# Altium project Li-Ion_Battery_Charger.PrjPcb
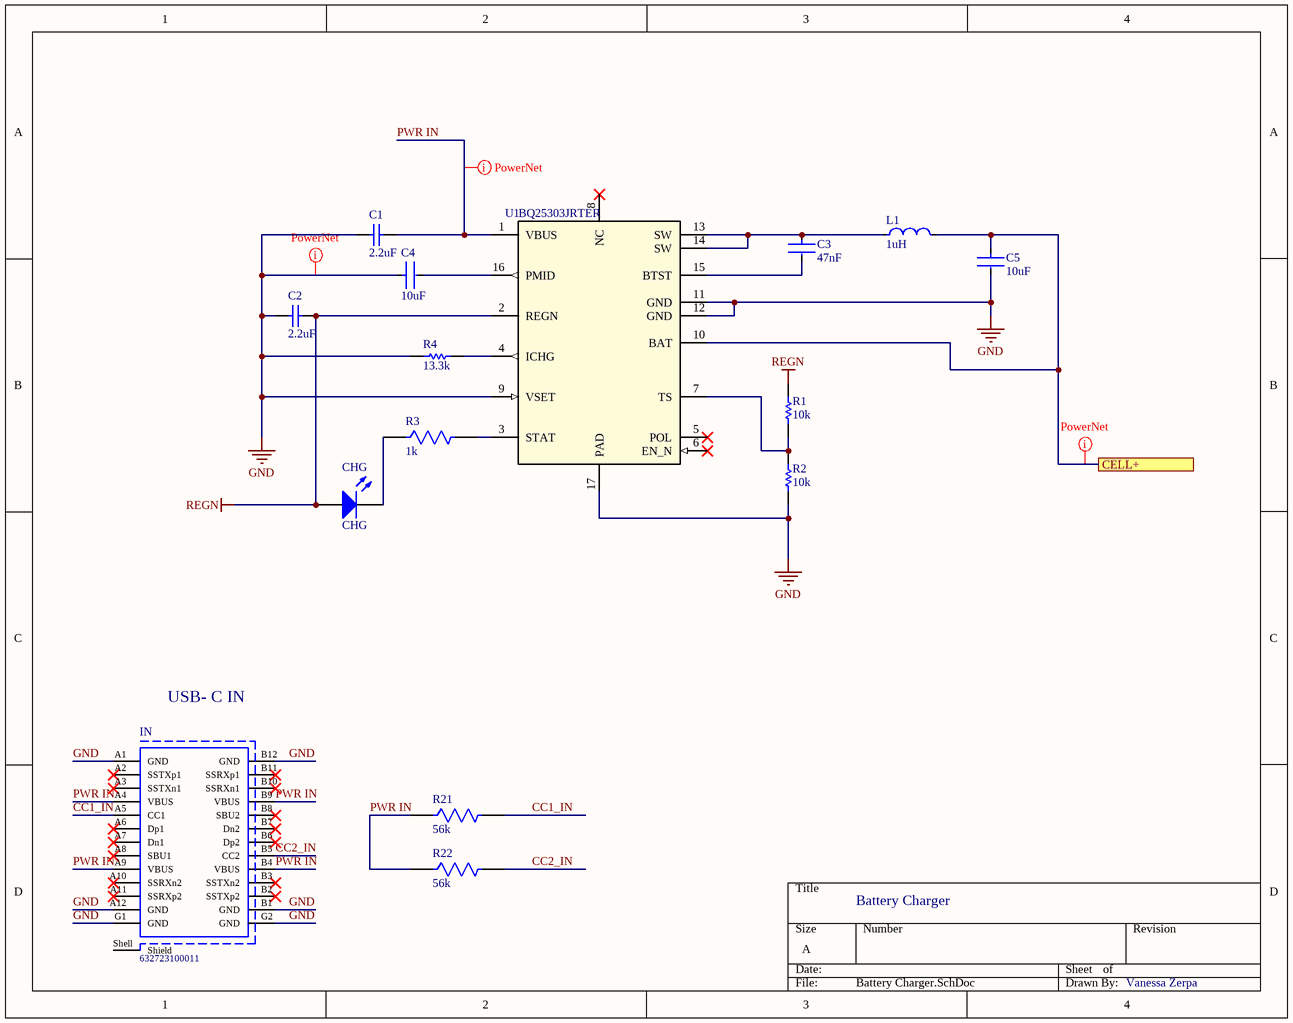
[diagram p0: Battery Charger.SchDoc]
4 sheets, 53 parts. Net scope: flat (ports and power ports of the same name join across sheets).
Board file: Li-IonBatteryCharger.PcbDoc
Sheets:
  Battery Charger.SchDoc
  Boost Converter.SchDoc
  Battery Protection.SchDoc
  Battery Fuel Gauge.SchDoc

## Sheet Battery Charger.SchDoc
size A; SheetNumber: 1; SheetTotal: 4

### Parts
C1  2.2uF  [CAPC2013X152X50ML20T25]
C2  2.2uF  [CAPC2013X152X50ML20T25]
C3  47nF  [FP-C0805C-DN-MFG]
C4  10uF  [FP-C0805C-DG-MFG]
C5  10uF  [FP-C0805C-DG-MFG]
CHG  CHG  [0805_A]
IN  632723100011  [632723100011]
L1  1uH  [FP-LQM21DN_00-MFG]
R1  10k  [RESC2013X60X35NL10T20]
R2  10k  [RESC2013X60X35NL10T20]
R3  1k  [FP-CRCW0805-HPe3-IPC_A]
R4  13.3k  [RESC2013X70X40LL20T20]
R21  56k  [FP-CRCW0805-e3-IPC_B]
R22  56k  [FP-CRCW0805-e3-IPC_B]
U1  BQ25303JRTER  [RTE0016C]

### Ports
CELL+

### Nets
GND: C1.1 C2.1 C4.1 C5.2 IN.A1(GND) IN.A12(GND) IN.B1(GND) IN.B12(GND) IN.G1(GND) IN.G2(GND) R2.1 R4.1 U1.9(VSET) U1.11(GND) U1.12(GND) U1.17(PAD)
REGN: C2.2 CHG.2(A) R1.2 U1.2(REGN)
CC1_IN: IN.A5(CC1) R21.2
CC2_IN: IN.B5(CC2) R22.2
PWR IN: C1.2 IN.A4(VBUS) IN.A9(VBUS) IN.B4(VBUS) IN.B9(VBUS) R21.1 R22.1 U1.1(VBUS)
NetBATT_1: C5.1 L1.2 U1.10(BAT) ; port CELL+
NetC3_1: C3.1 L1.1 U1.13(SW) U1.14(SW)
NetC3_2: C3.2 U1.15(BTST)
NetC4_2: C4.2 U1.16(PMID)
NetCHG_1: CHG.1(K) R3.1
NetR1_1: R1.1 R2.2 U1.7(TS)
NetR3_2: R3.2 U1.3(STAT)
NetR4_2: R4.2 U1.4(ICHG)

Not connected (* = marked no-connect by the designer): IN A2(SSTXp1)* A3(SSTXn1)* A6(Dp1)* A7(Dn1)* A8(SBU1)* A10(SSRXn2)* A11(SSRXp2)* B2(SSTXp2)* B3(SSTXn2)* B6(Dp2)* B7(Dn2)* B8(SBU2)* B10(SSRXn1)* B11(SSRXp1)* Shell(Shield); U1 5(POL)* 6(EN_N)* 8(NC)*

### Layout directives
net class PowerNets: GND, NetBATT_1, PWR IN

### Notes on the sheet
- USB- C IN
- Battery Charger
- Vanessa Zerpa

### Library data of the parts
C1 C2 = CMP-2007-04514-1: Part Number: 08053C225KAT2A; Manufacturer: AVX Interconnect / Elco
C3 = CMP-2007-03315-2: CAP CER 0.047UF 25V 5% NP0 0805; Manufacturer Part Number: C0805C473J3GACTU; Manufacturer: KEMET; Tolerance: 0.05; Temperature Coefficient: 30ppm/°C; Material: Ceramic; Capacitance: 47,000 pF; Value: 47,000 pF; Temperature Characteristic: C0G; Device Class L3: Ceramic Capacitors; Temperature Range Low: -55°C; Category: Cap; Lead Free: Yes; Digikey Description: CAP CER 0.047UF 25V 5% NP0 0805; Ipc Land Pattern Name: CAPC200125X78; Device Class L1: Passive Components; Device Class L2: Capacitors; Temperature: -55°C to +125°C; Voltage Rating: 25 V; Height: 0.88mm; Package: C0805C-DN; Automotive: No; Octopart: https://octopart.com/c0805c473j3gactu-kemet-9563153; ComponentLink2Description: Datasheet; Mouser Description: Multilayer Ceramic Capacitors MLCC - SMD/SMT 25volts 0.047uF 5% C0G; ComponentLink2URL: https://content.kemet.com/datasheets/KEM_C1003_C0G_SMD.pdf; RoHS: TRUE; Temperature Range High: +125°C
C4 C5 = CMP-2007-03243-2: CAP CER 10UF 10V X5R 0805; Manufacturer Part Number: C0805C106K8PACTU; Manufacturer: Kemet; 3DS Part Number: 220-00001; Tolerance: 10%; Temperature Coefficient: 15%; Material: Ceramic; Device Class L2: Capacitors; Device Class L1: Passive Components; ComponentLink2URL: https://content.kemet.com/datasheets/KEM_C1006_X5R_SMD.pdf; Height: 1.4mm; Lead Free: Yes; Digikey Description: CAP CER 10UF 10V X5R 0805; Octopart: https://octopart.com/c0805c106k8pactu-kemet-98697; Capacitance: 10uF; Value: 10uF; Temperature Range Low: -55°C; Temperature: -55°C to +85°C; Automotive: No; Mouser Description: CAP CER 10UF 10V X5R 0805; Ipc Land Pattern Name: CAPC200125X125; Temperature Range High: +85°C; Voltage: 10V; RoHS: TRUE; Device Class L3: Ceramic Capacitors; ComponentLink2Description: Datasheet; Voltage Rating: 10V; Package: C0805C-DG; Temperature Characteristic: X5R; Category: Cap
CHG = CMP-1426-00011-1: SMD mono-color Chip LED, WL-SMCW, Red; PartNumber: 150080RS75000; Manufacturer: Wuerth Elektronik; Color: Red; PackageReference: 0805_A; ComponentLink2Description: Datasheet; ComponentLink1URL: http://www.we-online.com; ComponentLink1Description: Manufacturer URL; ComponentLink2URL: http://katalog.we-online.com/led/datasheet/150080RS75000.pdf
IN = CMP-1502-03213-1: USB 3.1 Type C Receptacle WR-COM, Horizontal, SMT / THT; Manufacturer: Wurth Elektronik; Working Voltage: 20VDC; Rated Current: 5A; Contact Resistance: 30mOhm; Operating Temperature: -40to105degC; Publisher: WurthElektronik; Gender: Receptacle; Part Number: 632723100011; Mounting Technology: SMT/THT; Datasheet URL: https://katalog.we-online.de/em/datasheet/632723x00011%282%29.pdf; Connector Type: USB3.1TypeC; Manufacturer URL: http://www.we-online.de; Orientation: Horizontal; Package Reference: 632723100011; Packaging: TapeandReel
L1 = CMP-06042-012978-1: Multilayer Type Inductor for General Circuits, 0805 (2012), 1μH, 10%, 0.4Ω, 50mA; Q Factor: 45; Test Frequency: 10MHz; DC Resistance (DCR): 400mR; Core Material: Ferrite; Shielding: Shielded; Self Resonant Frequency: 107MHz; Mount: Surface Mount; Depth: 1.45mm; Current Rating: 50mA; Lead Free: Lead Free; Height - Seated (Max): 0.041inch; Inductance Tolerance: 10%; Min Operating Temperature: -40°C; Height: 0.85mm; Radiation Hardening: No; Width: 1.25mm; Length: 2mm; Case Code (Imperial): 0805; Termination: SMD/SMT; Package Quantity: 1; Max Operating Temperature: 85°C; Case Code (Metric): 2012; Case/Package: 0805; Max DC Current: 50mA; DC Current: 50mA; Inductance: 1uH; Military Standard: Not; REACH SVHC: No SVHC; Packaging: Tape and Reel; Tolerance: 10%
R1 R2 = CMP-1659-00013-4: Chip Resistor, 10 KOhm, +/- 1%, 0.125 W, -55 to 155 degC, 0805 (2012 Metric), RoHS, Tape and Reel; Manufacturer: Yageo; Voltage Rating: 150 V; Mount: Surface Mount; ComponentLink1Description: Manufacturer URL; ComponentLink2URL: http://www.yageo.com/documents/recent/PYu-RC_Group_51_RoHS_L_04.pdf; Pins: 2; Length: 2 mm; Min Operating Temperature: -55 degC; Height: 0.5 mm; Mounting Technology: Surface Mount; RoHSCompliant: true; REACH SVHC: No SVHC; ComponentLink1URL: http://www.yageo.com/; Max Operating Temperature: 155 degC; PackageReference: 0805; DatasheetVersion: Rev. 4, 02/2016; Package Quantity: 5000; Packaging: Tape and Reel; ComponentLink2Description: Datasheet; PackageDescription: 2-Pin Surface Mounted Device, Body 2 x 1.25 mm
R3 = CMP-02407-004529-1: RES Thick Film, 1kΩ, 1%, 0.5W, 100ppm/°C, 0805; Resistance: 1kR; Voltage Rating (DC): 150V; Power Rating: 330mW; Contact Plating: Tin; Composition: Thick Film; Packaging: Tape and Reel; Min Operating Temperature: -55°C; Weight: 0.000194oz; Case/Package: 0805; Case Code (Imperial): 0805; Case Code (Metric): 2012; Height: 0.5mm; Military Standard: Not; Lead Free: Lead Free; Voltage Rating: 150V; Number of Pins: 2; Max Operating Temperature: 155°C; Package Quantity: 5000; Mount: Surface Mount; Temperature Coefficient: 100ppm/°C; Tolerance: 1%; Radiation Hardening: No; Depth: 1.25mm; Length: 2mm; Termination: Solder; Width: 1.2mm
R4 = CMP-2001-04421-1: Manufacturer: Panasonic; Part Number: ERJ-6ENF1332V
R21 R22 = CMP-2001-04015-2: RES Thick Film, 56kΩ, 1%, 0.125W, 100ppm/°C, 0805; Resistance: 56kR; Power Rating: 125mW; Voltage Rating: 150V; Depth: 1.25mm; Contact Plating: Tin; Package Quantity: 10; Min Operating Temperature: -55°C; Case/Package: 0805; Packaging: Tape and Reel; Lead Free: Lead Free; Case Code (Imperial): 0805; Tolerance: 1%; Height: 0.45mm; Max Operating Temperature: 155°C; Case Code (Metric): 2012; Number of Pins: 2; Width: 1.25mm; Mount: Surface Mount; Voltage Rating (DC): 150V; Max Power Dissipation: 125mW; Weight: 0.000194oz; Termination: SMD/SMT; Length: 2mm; Radiation Hardening: No; Composition: Thick Film; Features: Automotive AEC-Q200; Number of Terminations: 2; Temperature Coefficient: 100ppm/°C; Military Standard: Not
U1 = BQ25303JRTER: Standalone 1-cell 17-V, 3.0-A battery charger with JEITA battery temperature monitoring 16-WQFN -40 to 85; Mfr_Name: Texas Instruments; Type: DEV; RefDes: RefDes; Copyright: Copyright (C) 2021 Ultra Librarian. All rights reserved.; Manufacturer_Part_Number: BQ25303JRTER; Supplier 1: Mouser; Manufacturer: Texas Instruments; Manufacturer Part Number: BQ25303JRTER; RoHS: Yes; Category: Integrated Circuits (ICs); Stock 1: 48; Pricing 1: 1=2.18000, 10=1.97000, 25=1.86000, 50=1.86000, 100=1.59000, 250=1.49000, 500=1.30000, 1000=1.08000, 3000=1.07000, 10000=1.07000 (USD); Supplier Part Number 1: 595-BQ25303JRTER

## Sheet Boost Converter.SchDoc
size A; SheetNumber: 2; SheetTotal: 4
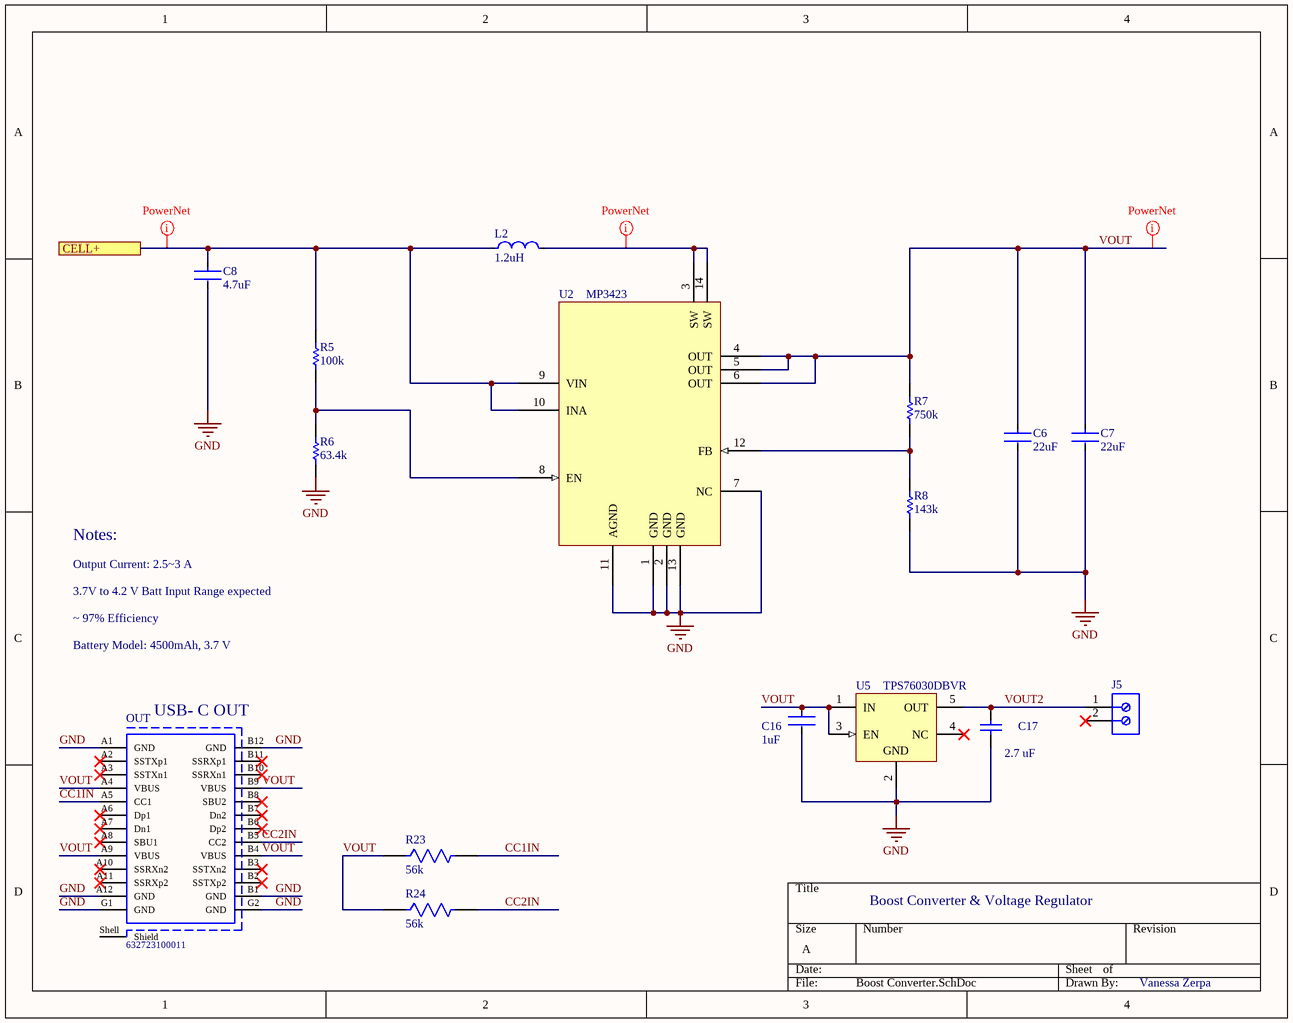
[diagram p1: Boost Converter.SchDoc]

### Parts
C6  22uF  [FP-GRM21B-0_15-MFG]
C7  22uF  [FP-GRM21B-0_15-MFG]
C8  4.7uF  [FP-0805-L_2_01_0_2-W_1_25-MFG]
C16  1uF  [FP-CC0805-0_85-MFG]
C17  2.7 uF  [CAPC2013X145X50LL20T25]
J5  691101710002  [691101710002]  (value not drawn)
L2  1.2uH  [FP-LQW21HN_00-MFG]
OUT  632723100011  [632723100011]
R5  100k  [RESC2013X60X35ML10T20]
R6  63.4k  [RESC2013X50X30LL20T20]
R7  750k  [RESC2013X50X30LL20T20]
R8  143k  [RESC2013X70X40LL20T20]
R23  56k  [FP-CRCW0805-e3-IPC_B]
R24  56k  [FP-CRCW0805-e3-IPC_B]
U2  MP3423  [MP3422GGZ]
U5  TPS76030DBVR  [DBV0005A_L]

### Ports
CELL+

### Nets
GND: C6.2 C7.2 C8.2 C16.2 C17.2 OUT.A1(GND) OUT.A12(GND) OUT.B1(GND) OUT.B12(GND) OUT.G1(GND) OUT.G2(GND) R6.1 R8.1 U2.1(GND) U2.2(GND) U2.7(NC) U2.11(AGND) U2.13(GND) U5.2(GND)
CC1IN: OUT.A5(CC1) R23.2
CC2IN: OUT.B5(CC2) R24.2
VOUT: C6.1 C7.1 C16.1 OUT.A4(VBUS) OUT.A9(VBUS) OUT.B4(VBUS) OUT.B9(VBUS) R7.2 R23.1 R24.1 U2.4(OUT) U2.5(OUT) U2.6(OUT) U5.1(IN) U5.3(EN)
VOUT2: C17.1 J5.1 U5.5(OUT)
NetBATT_1: C8.1 L2.1 R5.2 U2.9(VIN) U2.10(INA) ; port CELL+
NetL2_2: L2.2 U2.3(SW) U2.14(SW)
NetR5_1: R5.1 R6.2 U2.8(EN)
NetR7_1: R7.1 R8.2 U2.12(FB)

Not connected (* = marked no-connect by the designer): J5 2*; OUT A2(SSTXp1)* A3(SSTXn1)* A6(Dp1)* A7(Dn1)* A8(SBU1)* A10(SSRXn2)* A11(SSRXp2)* B2(SSTXp2)* B3(SSTXn2)* B6(Dp2)* B7(Dn2)* B8(SBU2)* B10(SSRXn1)* B11(SSRXp1)* Shell(Shield); U5 4(NC)*

### Layout directives
net class PowerNets: NetBATT_1, NetL2_2, VOUT

### Notes on the sheet
- Notes:
- Output Current: 2.5~3 A
- 3.7V to 4.2 V Batt Input Range expected
- ~ 97% Efficiency
- Battery Model: 4500mAh, 3.7 V
- (near OUT) USB- C OUT
- Boost Converter & Voltage Regulator
- Vanessa Zerpa

### Library data of the parts
C6 C7 = CMP-2007-03385-2: Chip Multilayer Ceramic Capacitors for General Purpose, 0805, 22uF, X5R, 15%, 20%, 6.3V; Material: Ceramic; Max Operating Temperature: 85°C; Voltage: 6.3V; Min Operating Temperature: -55°C; Case/Package: 0805; Thickness: 0.053inch; Dielectric: X5R; Packaging: Tape and Reel; Depth: 1.25mm; Termination: SMD/SMT; Voltage Rating (DC): 6.3V; Radiation Hardening: No; Tolerance: 20%; Mount: Surface Mount; Lead Free: Lead Free; Package Quantity: 1; REACH SVHC: No SVHC; Voltage Rating: 6.3V; Capacitance: 22uF; Length: 2mm; Case Code (Imperial): 0805; Case Code (Metric): 2012; Width: 0.049inch; Height: 1.25mm
C8 = CMP-2007-04518-2: General Purpose Ceramic Capacitor, 0805, 4.7uF, 10%, X7R, 15%, 16V; Dissipation Factor: 3.5%; Voltage: 10V; Height: 1.52mm; Package Quantity: 1; Voltage Rating: 16V; RoHS Compliant: Yes; Mount: Surface Mount; REACH SVHC: No SVHC; Number of Pins: 2; Packaging: Tape and Reel; Radiation Hardening: No; Thickness: 0.06inch; Width: 0.049inch; Length: 2.01mm; Termination: SMD/SMT; Case Code (Metric): 2012; Max Operating Temperature: 125°C; Construction: Flat; Series: -; Depth: 1.25mm; Voltage Rating (DC): 16V; Dielectric: X7R; Contact Plating: Tin; Tolerance: 10%; Capacitance: 4.7uF; Lead Free: Lead Free; Min Operating Temperature: -55°C; Case Code (Imperial): 0805; Case/Package: 0805
C16 = CMP-03422-000182-1: CAP CER 1UF 10V X7R 0805; Manufacturer: Yageo; Manufacturer Part Number: CC0805KKX7R6BB105; Material: Ceramic; Tolerance: 0.1; Value: 1 uF; ComponentLink2URL: http://www.yageo.com/documents/recent/UPY-GPHC_Y5V_6.3V-to-50V_8.pdf; Automotive: No; Temperature Range Low: -30°C; Octopart: https://octopart.com/cc0805kkx7r6bb105-yageo-42522859; Temperature Characteristic: X7R; RoHS: TRUE; Voltage Rating: 10 V; Capacitance: 1 uF; Package: CC0805-0.85; Device Class L3: Ceramic Capacitors; Category: Cap; Mouser Description: Multilayer Ceramic Capacitors MLCC - SMD/SMT 1.0uF 10V X7R 10%; Temperature Range High: +85°C; Ipc Land Pattern Name: CAPC200125X85; ComponentLink2Description: Datasheet; Temperature: -30°C to +85°C; Height: 0.95mm; Lead Free: Yes; Device Class L1: Passive Components; Device Class L2: Capacitors; Footprint Url: http://www.yageo.com/exep/pages/download/literatures/UPY-C_GEN_24.pdf; Digikey Description: CAP CER 1UF 10V X7R 0805
C17 = CMP-1036-04849-2: Part Number: C0805C275K8PACTU; Manufacturer: Kemet
J5 = CMP-1502-03256-1: Series 101 - 5.00 mm Horizontal Entry Modular with Pressure Clamp WR-TBL, 2 pin; Manufacturer: Wurth Elektronik; Pin Number: 2; Pitch: 5.00mm; Package Reference: 691101710002; Part Number: 691101710002; Publisher: WurthElektronik; Datasheet URL: http://katalog.we-online.de/em/datasheet/6911017100xx.pdf; Packaging: Box; Operating Temperature: -40to105degC; Manufacturer URL: http://www.we-online.de; Mounting Technology: THT
L2 = CMP-06042-002176-1: Wire Wound Ferrite type RF Inuctor 1.2uH ±5% 100mA 3.12Ω 0805 (2012); DC Resistance (DCR): 3.12R; Shielding: Unshielded; Self Resonant Frequency: 400MHz; Test Frequency: 10MHz; Q Factor: 35; Case Code (Imperial): 0805; Military Standard: Not; Inductance: 1.2uH; Packaging: Tape and Reel; Package Quantity: 3000; Case/Package: 0805; Resistor Type: Wirewound; Width: 1.5mm; Height - Seated (Max): 0.039inch; Tolerance: 5%; Lead Free: Lead Free; Termination: SMD/SMT; Current Rating: 100mA; Length: 2mm; Depth: 1.4mm; DC Current: 100mA; Height: 0.9mm; Min Operating Temperature: -55°C; Mount: Surface Mount; Case Code (Metric): 2012; Radiation Hardening: No; Weight: 0.000282oz; Max Operating Temperature: 85°C; Max DC Current: 100mA; Core Material: Ferrite
OUT = CMP-1502-03213-1: as IN on sheet Battery Charger; Operating Temperature: -40to105degC; Publisher: WurthElektronik; Gender: Receptacle; Part Number: 632723100011; Mounting Technology: SMT/THT; Datasheet URL: https://katalog.we-online.de/em/datasheet/632723x00011%282%29.pdf; Connector Type: USB3.1TypeC; Manufacturer URL: http://www.we-online.de; Orientation: Horizontal; Package Reference: 632723100011; Packaging: TapeandReel
R5 = CMP-2100-03668-1: Chip Resistor, 100 KOhm, +/- 1%, 0.125 W, -55 to 155 degC, 0805 (2012 Metric), RoHS, Tape and Reel; Manufacturer: Yageo; Max Power Dissipation: 125mW; Voltage Rating: 150V; Temperature Coefficient: 100ppm/degreesC; Manufacturer URL: http://www.yageo.com/; Min Operating Temperature: -55degC; Lead Pitch: 0.4mm; Composition: ThickFilm; Case Code (Metric): 2012; Military Standard: Not; Package Description: 2-Pin Surface Mounted Device, Body 2 x 1.25 mm; REACH SVHC: Unknown; RoHSCompliant: true; Depth: 1.25mm; Number of Pins: 2; Lead Free: LeadFree; Resistance: 100KOhm; Datasheet URL: http://www.yageo.com/NewPortal/yageodocoutput?fileName=/pdf/R-Chip/PYu-RC_Group_51_RoHS_L_5.pdf; Max Operating Temperature: 155degC; Case/Package: 0805; Package Quantity: 1; Case Code (Imperial): 0805; Power Rating: 125mW; Width: 0.049inch; Package Reference: 0805; Height: 0.024inch; Termination: SMD/SMT; Tolerance: 1%; Datasheet Version: Rev. 5, 10/2016; Length: 2mm; Voltage Rating (DC): 150V; Number of Terminations: 2; Packaging: TapeandReel
R6 = CMP-2001-04057-1: Part Number: CRCW080563K4FKEA; Manufacturer: Vishay Dale
R7 = CMP-2001-04102-1: Manufacturer: Vishay Dale; Part Number: CRCW0805750KFKEA
R8 = CMP-2001-04433-1: Manufacturer: Panasonic; Part Number: ERJ-6ENF1433V
R23 R24 = CMP-2001-04015-2: as R21 on sheet Battery Charger; Depth: 1.25mm; Contact Plating: Tin; Package Quantity: 10; Min Operating Temperature: -55°C; Case/Package: 0805; Packaging: Tape and Reel; Lead Free: Lead Free; Case Code (Imperial): 0805; Tolerance: 1%; Height: 0.45mm; Max Operating Temperature: 155°C; Case Code (Metric): 2012; Number of Pins: 2; Width: 1.25mm; Mount: Surface Mount; Voltage Rating (DC): 150V; Max Power Dissipation: 125mW; Weight: 0.000194oz; Termination: SMD/SMT; Length: 2mm; Radiation Hardening: No; Composition: Thick Film; Features: Automotive AEC-Q200; Number of Terminations: 2; Temperature Coefficient: 100ppm/°C; Military Standard: Not
U5 = CMP-0394-00493-2: Single Output LDO, 50 mA, Fixed 3 V Output, 3.2 to 16 V Input, with Low IQ, 5-pin SOT-23 (DBV), -40 to 125 degC, Green (RoHS & no Sb/Br); Manufacturer: Texas Instruments; Accuracy(%): 2; Vin(Max)(V): 16; Iq(Typ)(mA): 0.8; Iout(Max)(A): 0.05; Vin(Min)(V): 3.2; Vout Adj(Max)(V): 3; SubFamily: Single Channel LDO; Vdo(Typ)(mV): 120; Rating: Catalog; ComponentLink1URL: http://www.ti.com/; ComponentLink1Description: Manufacturer URL; Code_JEDEC: MO-178; PackageDescription: 5-Pin Plastic Small Outline, Body 1.60 Ãƒâ€” 2.90 mm, Pitch 0.95 mm; PartNumber: TPS76030DBVR; ComponentLink2Description: Datasheet; Mounting Technology: Surface Mount; ComponentLink3Description: Package Specification; ComponentLink2URL: http://www.ti.com/general/docs/lit/getliterature.tsp?genericPartNumber=TPS76030&fileType=pdf; ComponentLink3URL: http://www.ti.com/litv/pdf/mpds018i; Eco-Plan: Green (RoHS & no Sb/Br); DatasheetVersion: SLVS144D; PackageVersion: 4073253-4/K; Fixed Output Options(V): 3; Vout Adj(Min)(V): 3; PackageReference: DBV0005A

## Sheet Battery Protection.SchDoc
size A; SheetNumber: 3; SheetTotal: 4
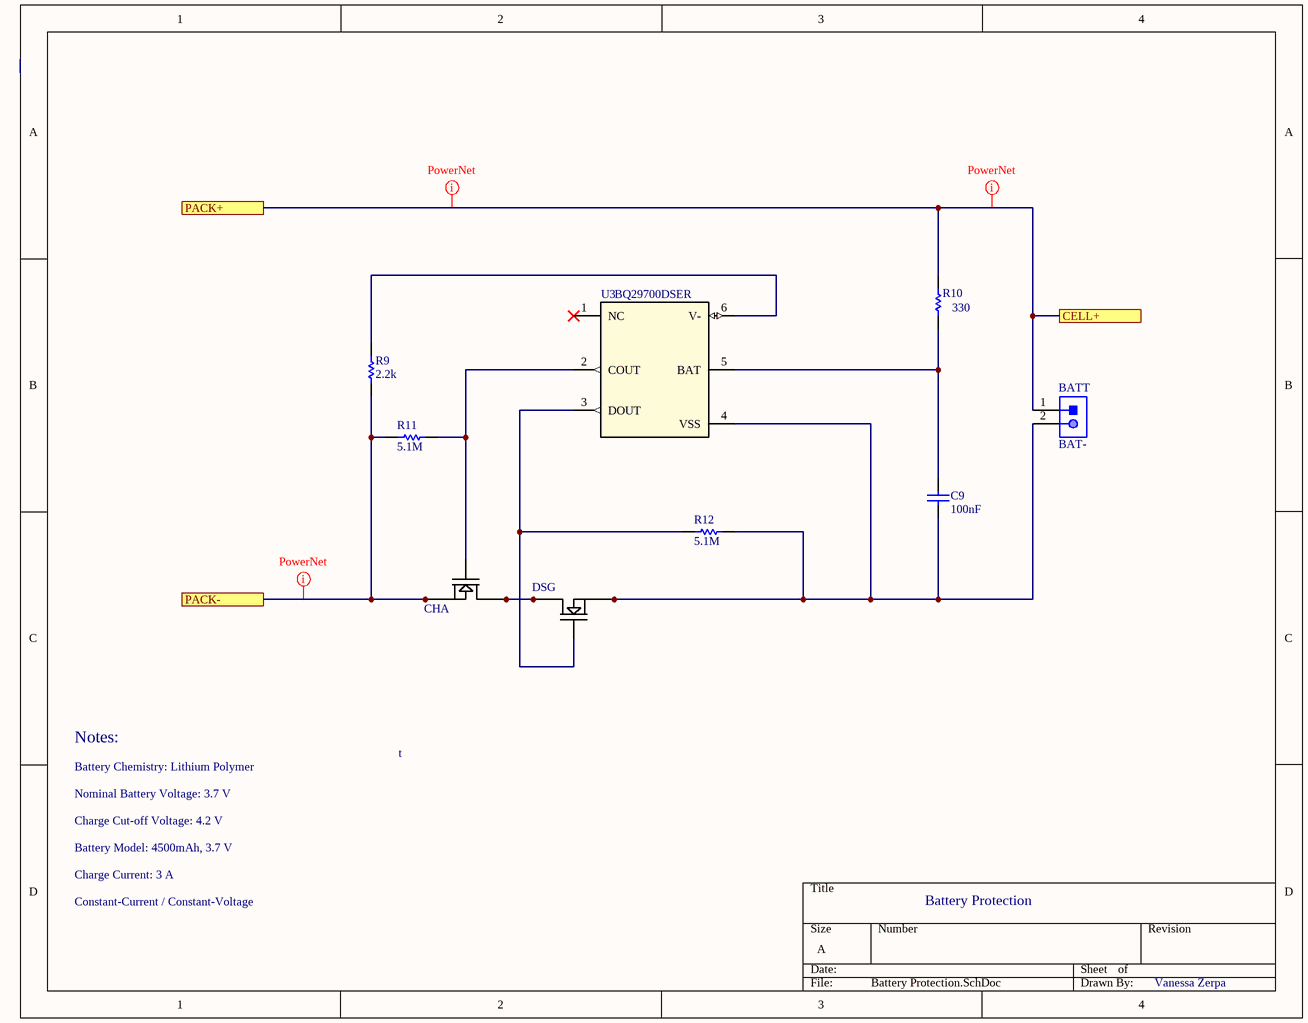
[diagram p2: Battery Protection.SchDoc]

### Parts
BATT  BAT-  [JST-S2B-PH-K-S_V]
C9  100nF  [CAPC2013X94X50NL20T25]
CHA  CSD16406Q3  [DQG0008A]  (value not drawn)
DSG  CSD16406Q3  [DQG0008A]  (value not drawn)
R9  2.2k  [RESC2013X60X40LL20T25]
R10  330  [RESC2013X70X40ML20T20]
R11  5.1M  [RESC2013X70X40ML20T20]
R12  5.1M  [RESC2013X70X40ML20T20]
U3  BQ29700DSER  [DSE0006A]

### Ports
CELL+, PACK+, PACK-

### Nets
NetBATT_1: BATT.1 R10.2 ; port PACK+, port CELL+
NetBATT_2: BATT.2 C9.1 DSG.1(Source) DSG.2(Source) DSG.3(Source) R12.2 U3.4(VSS)
NetC9_2: C9.2 R10.1 U3.5(BAT)
NetCHA_1: CHA.1(Source) CHA.2(Source) CHA.3(Source) R9.1 R11.1 ; port PACK-
NetCHA_4: CHA.4(Gate) R11.2 U3.2(COUT)
NetCHA_5: CHA.5(Drain) CHA.6(Drain) CHA.7(Drain) CHA.8(Drain) CHA.9(Drain) DSG.5(Drain) DSG.6(Drain) DSG.7(Drain) DSG.8(Drain) DSG.9(Drain)
NetDSG_4: DSG.4(Gate) R12.1 U3.3(DOUT)
NetR9_2: R9.2 U3.6(V-)

Not connected (* = marked no-connect by the designer): U3 1(NC)*

### Layout directives
net class PowerNets: NetBATT_1, NetCHA_1

### Notes on the sheet
- Notes:
- Battery Chemistry: Lithium Polymer
- t
- Nominal Battery Voltage: 3.7 V
- Charge Cut-off Voltage: 4.2 V
- Battery Model: 4500mAh, 3.7 V
- Charge Current: 3 A
- Constant-Current / Constant-Voltage
- Battery Protection
- Vanessa Zerpa

### Library data of the parts
BATT = CMP-1755-00004-1: Male Header, Pitch 2 mm, 1 x 2 Position, Height 4.8 mm, Tail Length 3.4 mm, -25 to 85 degC, RoHS, Bulk; Case\Package: Radial; Tolerance: 20%; Capacitance: 10 uF; Voltage Rating (DC): 50 V; Packaging: Bulk; ComponentLink1URL: http://www.jst-mfg.com/product/pdf/eng/ePH.pdf; Radiation Hardening: No; Height: 11 mm; Package Quantity: 200; PackageDescription: Male Header, Pitch 2 mm, 1 x 2 Position, Height 4.8 mm, Tail Length 3.4 mm; PackageReference: S2B-PH-K-S; Diameter: 5 mm; Pins: 2; Mount: Through Hole; Max Operating Temperature: 85 degC; Min Operating Temperature: -40 degC; ComponentLink1Description: Datasheet; DatasheetVersion: Dec-12; Length: 11 mm; Lead Pitch: 2 mm; REACH SVHC: No SVHC; Voltage Rating: 50 V; RoHSCompliant: true
C9 = CMP-1036-04419-2: Manufacturer: AVX Interconnect / Elco; Part Number: 08055C104KAT4A
CHA DSG = CSD16406Q3: No Description Available; Mfr_Name: Texas Instruments; Copyright: Copyright (C) 2021 Ultra Librarian. All rights reserved.; Manufacturer_Part_Number: CSD16406Q3; RefDes: RefDes; Type: DEV
R9 = CMP-2001-00613-1: Manufacturer: Panasonic; Part Number: ERA6AEB222V
R10 = CMP-1013-00062-2: Manufacturer: Panasonic; Part Number: ERJ-6GEYJ331V
R11 R12 = CMP-2001-00430-1: Part Number: ERJ-6GEYJ515V; Manufacturer: Panasonic
U3 = BQ29700DSER: No Description Available; Mfr_Name: Texas Instruments; Type: DEV; RefDes: RefDes; Copyright: Copyright (C) 2021 Ultra Librarian. All rights reserved.; Manufacturer_Part_Number: BQ29700DSER

## Sheet Battery Fuel Gauge.SchDoc
size A; SheetNumber: 4; SheetTotal: 4
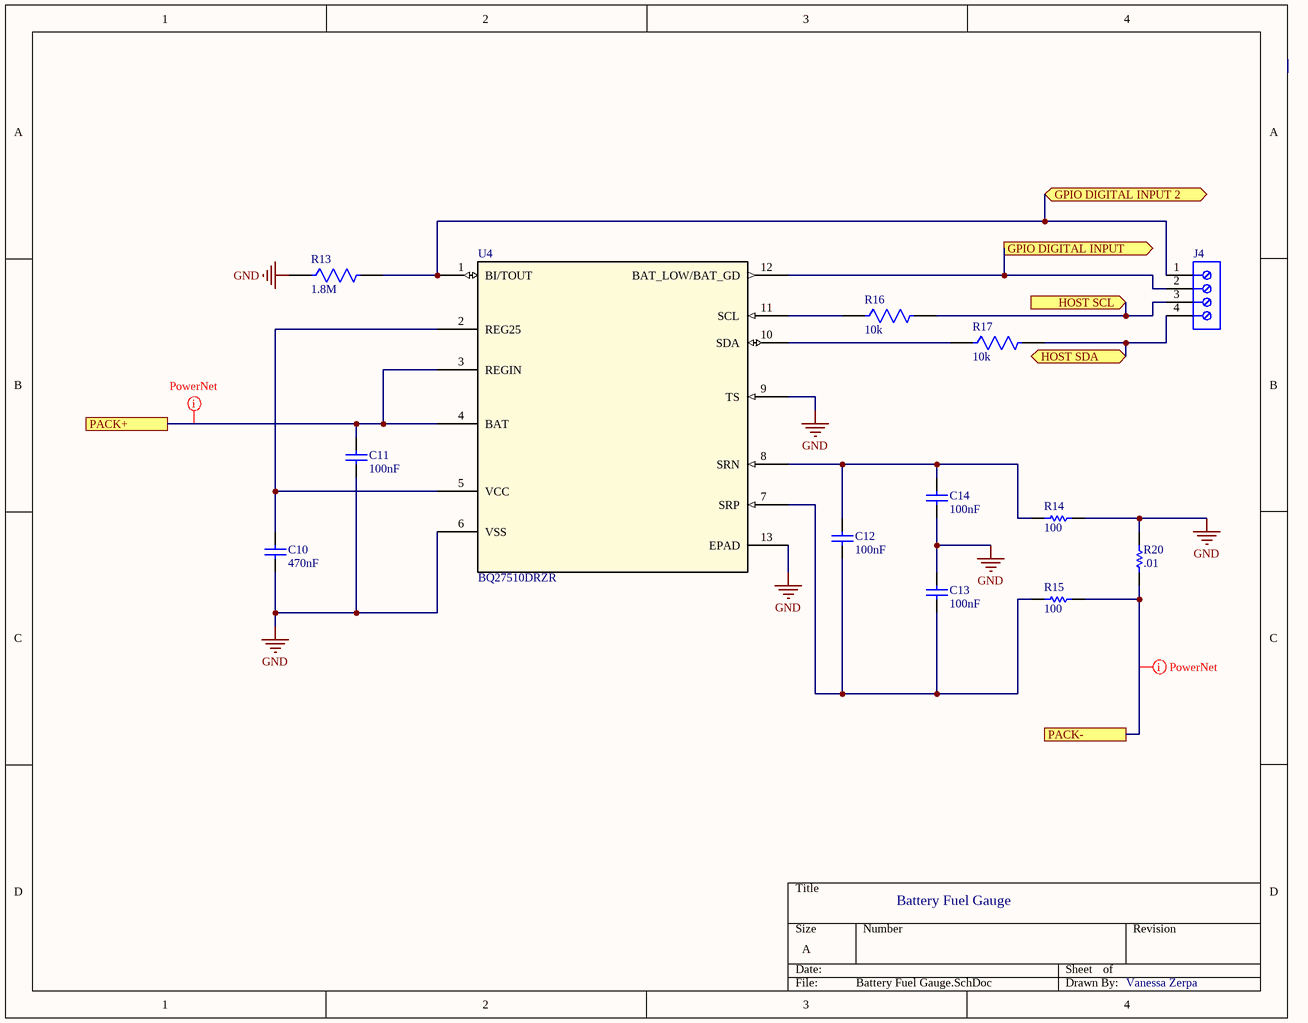
[diagram p3: Battery Fuel Gauge.SchDoc]

### Parts
C10  470nF  [CAPC2013X140X50ML20T25]
C11  100nF  [CAPC2013X94X50NL20T25]
C12  100nF  [CAPC2013X94X50NL20T25]
C13  100nF  [CAPC2013X94X50NL20T25]
C14  100nF  [CAPC2013X94X50NL20T25]
J4  Screw top terminal  [691709710304]  (value not drawn)
R13  1.8M  [FP-CRCW0805-e3-MFG]
R14  100  [RESC2013X60X40ML20T25]
R15  100  [RESC2013X60X40ML20T25]
R16  10k  [FP-CR0805-IPC_B]
R17  10k  [FP-CR0805-IPC_B]
R20  .01  [RESC2013X75X55NL20T20]
U4  BQ27510DRZR  [DRZ12_1P95X2P45]

### Ports
GPIO DIGITAL INPUT 2 (bidir), GPIO DIGITAL INPUT (out), HOST SCL (in), HOST SDA (bidir), PACK+, PACK-

### Nets
GND: C10.1 C11.1 C13.2 C14.1 R13.1 R14.2 R20.2 U4.6(VSS) U4.9(TS) U4.13(EPAD)
NetBATT_1: C11.2 U4.3(REGIN) U4.4(BAT) ; port PACK+
NetC10_2: C10.2 U4.2(REG25) U4.5(VCC)
NetC12_1: C12.1 C13.1 R15.1 U4.7(SRP)
NetC12_2: C12.2 C14.2 R14.1 U4.8(SRN)
NetCHA_1: R15.2 R20.1 ; port PACK-
NetJ4_1: J4.1 R13.2 U4.1(BI/TOUT) ; port GPIO DIGITAL INPUT 2
NetJ4_2: J4.2 U4.12(BAT_LOW/BAT_GD) ; port GPIO DIGITAL INPUT
NetJ4_3: J4.3 R16.2 ; port HOST SCL
NetJ4_4: J4.4 R17.2 ; port HOST SDA
NetR16_1: R16.1 U4.11(SCL)
NetR17_1: R17.1 U4.10(SDA)

### Layout directives
net class PowerNets: NetBATT_1, NetCHA_1

### Notes on the sheet
- Battery Fuel Gauge
- Vanessa Zerpa

### Library data of the parts
C10 = CMP-2007-04613-1: Manufacturer: AVX Interconnect / Elco; Part Number: 08053D474KAT2A
C11-C14 = CMP-1036-04419-2: as C9 on sheet Battery Protection
J4 = CMP-1502-03337-1: Serie 7097 - 5.00 mm Horizontal Entry SMT with Pressure Clamp WR-TBL, 4 pin; Manufacturer: Wurth Elektronik; Pin Number: 4; Pitch: 5.00mm; Mounting Technology: SMT; Package Reference: 691709710304; Datasheet URL: http://katalog.we-online.de/em/datasheet/6917097103xx.pdf; Packaging: TapeandReelwithCap; Part Number: 691709710304; Operating Temperature: -45to130degC; Publisher: WurthElektronik; Manufacturer URL: http://www.we-online.de
R13 = CMP-2001-03646-2: RES Thick Film, 1.8MΩ, 5%, 0.125W, 200ppm/°C, 0805; Voltage Rating: 150V; Max Power Dissipation: 125mW; Resistance: 1.8MR; Features: Automotive AEC-Q200; Package Quantity: 1; Contact Plating: Tin; Case Code (Imperial): 0805; Case/Package: 0805; Termination: SMD/SMT; Lead Free: Lead Free; Tolerance: 5%; Voltage Rating (DC): 150V; Weight: 0.000194oz; Depth: 1.25mm; Power Rating: 125mW; Military Standard: Not; Packaging: Tape and Reel; Length: 2mm; Height: 0.02inch; Number of Terminations: 2; Radiation Hardening: No; Composition: Thick Film; Case Code (Metric): 2012; Temperature Coefficient: 200ppm/°C; Max Operating Temperature: 155°C; Min Operating Temperature: -55°C; Width: 1.25mm
R14 R15 = CMP-2001-00580-1: Manufacturer: Panasonic; Part Number: ERA6AEB101V
R16 R17 = CMP-07231-003873-1: Thick Film Chip Resistors 0805 10kΩ 0.125W 5% 200ppm/°C; Resistance: 10kR; Power Rating: 125mW; Voltage Rating (DC): 100V; Voltage Rating: 150V; Width: 1.25mm; Composition: Thick Film; Packaging: Tape and Reel; Number of Terminations: 2; Min Operating Temperature: -55°C; Height: 0.5mm; Temperature Coefficient: 200ppm/°C; Features: Moisture Resistant; Termination: SMD/SMT; Case Code (Imperial): 0805; Package Quantity: 1; Radiation Hardening: No; Military Standard: Not; Thickness: 508um; Depth: 1.25mm; Tolerance: 5%; Contact Plating: Tin; Number of Pins: 2; Length: 2mm; Max Power Dissipation: 125mW; Mount: Surface Mount; Case Code (Metric): 2012; Case/Package: 0805; REACH SVHC: No SVHC; Max Operating Temperature: 155°C
R20 = CMP-2001-04363-1: Part Number: ERJ-6BWFR010V; Manufacturer: Panasonic
U4 = BQ27510DRZR: No Description Available; Mfr_Name: Texas Instruments; Copyright: Copyright (C) 2021 Ultra Librarian. All rights reserved.; Manufacturer_Part_Number: BQ27510DRZR; RefDes: RefDes; Type: DEV

## Nets that join several sheets
GND: Battery Charger (16 pins), Boost Converter (19 pins), Battery Fuel Gauge (10 pins)
NetBATT_1: Battery Charger (C5.1 L1.2 U1.10), Boost Converter (5 pins), Battery Protection (BATT.1 R10.2), Battery Fuel Gauge (C11.2 U4.3 U4.4)
NetCHA_1: Battery Protection (5 pins), Battery Fuel Gauge (R15.2 R20.1)